# Altium schematic sheet prom_dual.SchDoc: PROM
size A; Organization: UCLA HEP; DocumentNumber: 3; Revision: 2.0; SheetNumber: 3; SheetTotal: 14
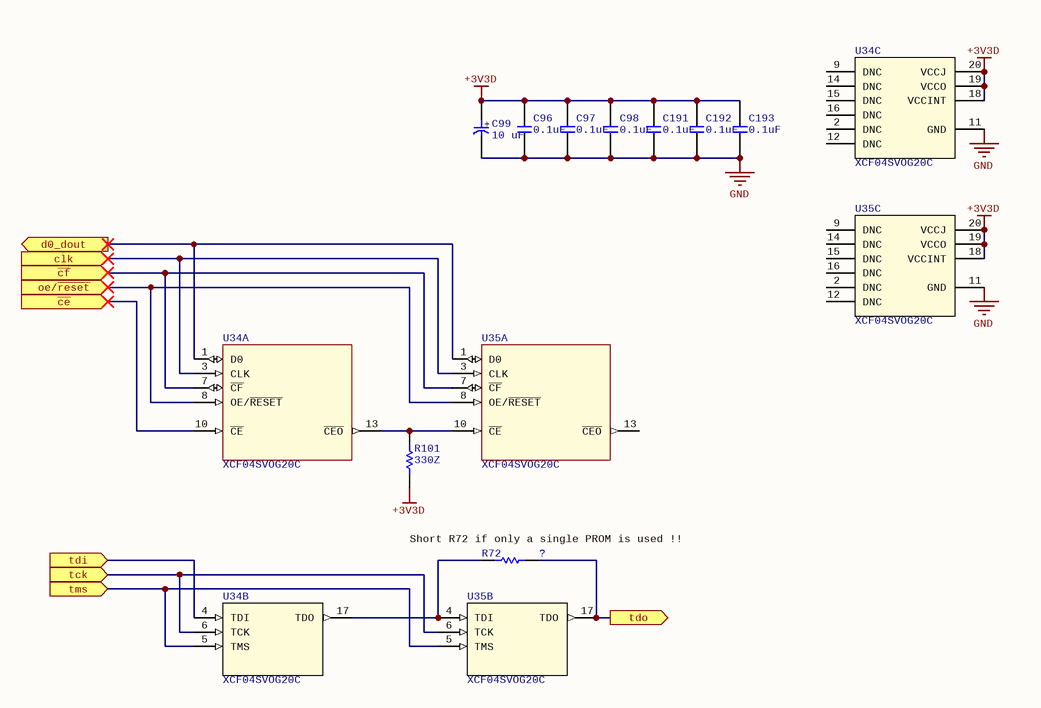
[diagram p0: prom_dual.SchDoc]

## Parts
C96  0.1uF  [C0603]
C97  0.1uF  [C0603]
C98  0.1uF  [C0603]
C99  10 uF  [KEMET 1206]
C191  0.1uF  [C0603]
C192  0.1uF  [C0603]
C193  0.1uF  [C0603]
R72  ?  [R0805]
R101  330Z  [R0603]
U34  XCF04SVOG20C  [R-PDSO-G20]  (parts A,B,C of 3)
U35  XCF04SVOG20C  [R-PDSO-G20]  (parts A,B,C of 3)

## Ports
clk (in), d0_dout (out), oe/~{reset} (in), tck (in), tdi (in), tdo (out), tms (in), ~{ce} (in), ~{cf} (in)

## Nets
+3V3D: C96.2 C97.2 C98.2 C99.1(+) C191.2 C192.2 C193.2 R101.1 U34.18(VCCINT) U34.19(VCCO) U34.20(VCCJ) U35.18(VCCINT) U35.19(VCCO) U35.20(VCCJ)
GND: C96.1 C97.1 C98.1 C99.2(-) C191.1 C192.1 C193.1 U34.11(GND) U35.11(GND)
~{ce}: U34.10(~{CE}) ; port ~{ce}
~{cf}: U34.7(~{CF}) U35.7(~{CF}) ; port ~{cf}
clk: U34.3(CLK) U35.3(CLK) ; port clk
d0_dout: U34.1(D0) U35.1(D0) ; port d0_dout
oe/~{reset}: U34.8(OE/~{RESET}) U35.8(OE/~{RESET}) ; port oe/~{reset}
tck: U34.6(TCK) U35.6(TCK) ; port tck
tdi: U34.4(TDI) ; port tdi
tdo: R72.2 U35.17(TDO) ; port tdo
tms: U34.5(TMS) U35.5(TMS) ; port tms
NetR72_1: R72.1 U34.17(TDO) U35.4(TDI)
NetR101_2: R101.2 U34.13(~{CEO}) U35.10(~{CE})

Not connected (* = marked no-connect by the designer): U34 2(DNC) 9(DNC) 12(DNC) 14(DNC) 15(DNC) 16(DNC); U35 2(DNC) 9(DNC) 12(DNC) 13(~{CEO}) 14(DNC) 15(DNC) 16(DNC)

## Notes on the sheet
- (near R72) Short R72 if only a single PROM is used !!
- Size:
- A
- Revision:
- Date:
- Sheet
- of

## Library data of the parts
C96-C98 C191-C193 = CAP/06035C104KAT2A: CAP2, CER, 0.1uF, 10%, 50V, 0603, X7R; Manufacturer: AVX Corporation; Capacitance: 0.10µF; Supplier 1: Digi-Key; Manufacturer Part Number: 06035C104KAT2A; RoHS: RoHS Compliant; Category: Capacitors; Stock 1: 4412408; Pricing 1: 1=0.1, 10=0.036, 25=0.0264, 50=0.0198, 100=0.0162, 250=0.01352, 500=0.01156, 1000=0.00908 (USD); Packaging: Cut Tape (CT); Tolerance: ±10%; Voltage - Rated: 50V; Temperature Coefficient: X7R; Mounting Type: Surface Mount, MLCC; Operating Temperature: -55°C ~ 125°C; Applications: General Purpose; Ratings: -; Package / Case: 0603 (1608 Metric); Size / Dimension: 0.063" L x 0.032" W (1.60mm x 0.81mm); Height - Seated (Max): -; Thickness (Max): 0.035" (0.90mm); Lead Spacing: -; Features: -; Lead Style: -; ComponentLink1URL: http://datasheets.avx.com/X7RDielectric.pdf; ComponentLink1Description: http://datasheets.avx.com/X7RDielectric.pdf; Supplier 2: Newark; Supplier Part Number 1: 478-5052-1-ND; Supplier Part Number 2: 54K2412
C99 = Kemet/T491A106K010AT: CAP2, TANT,  10uF, 10%, 10V, 1206; Manufacturer: Kemet; Manufacturer Size Code: A; Capacitance: 10µF; ESR (Equivalent Series Resistance): 3.8 Ohm; Type: Molded; Lifetime @ Temp.: 2000 Hrs @ 85°C; Supplier 1: Newark; Manufacturer Part Number: T491A106K010AT; RoHS: RoHS Compliant; Category: Capacitors; Packaging: Cut Tape (CT); Tolerance: ±10%; Voltage - Rated: 10V; Mounting Type: Surface Mount; Operating Temperature: -55°C ~ 125°C; Package / Case: 1206 (3216 Metric); Size / Dimension: 0.126" L x 0.063" W (3.20mm x 1.60mm); Height - Seated (Max): 0.071" (1.80mm); Lead Spacing: -; Features: General Purpose; ComponentLink1URL: http://www.kemet.com/Lists/ProductCatalog/Attachments/254/KEM_T2005_T491.pdf; ComponentLink1Description: http://www.kemet.com/Lists/ProductCatalog/Attachments/254/KEM_T2005_T491.pdf; Supplier Part Number 1: 57K1635; Supplier 2: Digi-Key; Stock 2: 145394; Pricing 2: 1=0.38, 10=0.337, 50=0.2044, 100=0.1684, 250=0.13468, 500=0.12266, 1000=0.11063 (USD); Supplier Part Number 2: 399-3684-6-ND; Supplier 3: Digi-Key; Supplier Part Number 3: 399-3684-1-ND
R72 = RES SMD ? OHM 1% 1/10W 0805: Placeholder
R101 = CRCW0603330RFKEA: RES0, SMD,  330Z, 1.0%, 1/10W, 0603; Manufacturer: Rohm Semiconductor; Manufacturer Part Number: MCR03ERTF3300; Resistance (Ohms): 330; Tolerance: ±1%; Power (Watts): 0.1W, 1/10W; Temperature Coefficient: ±100ppm/°C; Supplier 1: Digi-Key; RoHS: RoHS Compliant; Category: Resistors; Stock 1: 139947; Pricing 1: 1=0.1, 10=0.011, 25=0.0084, 100=0.0047, 250=0.00356, 500=0.00286, 1000=0.0021 (USD); Packaging: Cut Tape (CT); Composition: Thick Film; Features: -; Operating Temperature: -55°C ~ 155°C; Package / Case: 0603 (1608 Metric); Supplier Device Package: 0603 (1608 Metric); Size / Dimension: 0.063" L x 0.031" W (1.60mm x 0.80mm); Height: 0.022" (0.55mm); Number of Terminations: 2; ComponentLink1URL: http://rohmfs.rohm.com/en/products/databook/datasheet/passive/resistor/chip_resistor/mcr_g.pdf; ComponentLink1Description: http://rohmfs.rohm.com/en/products/databook/datasheet/passive/resistor/chip_resistor/mcr_g.pdf; Supplier Part Number 1: RHM330CFCT-ND
U34 U35 = XCF04SVOG20C TSSOP-20: PROM, 4M GATE, Platform Flash